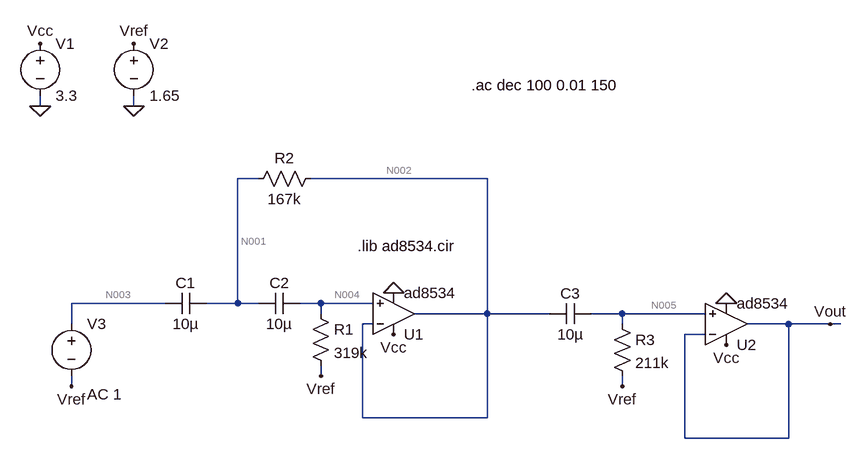
[diagram p0: schematic Draft1.asc]
Draft1.asc, the LTspice schematic file:
Version 4.1
SHEET 1 924 680
WIRE -336 -176 -336 -192
WIRE -192 -176 -192 -192
WIRE 0 -64 -32 -64
WIRE 352 -64 80 -64
WIRE -144 128 -288 128
WIRE -32 128 -32 -64
WIRE -32 128 -80 128
WIRE 0 128 -32 128
WIRE 96 128 64 128
WIRE 176 128 96 128
WIRE 96 144 96 128
WIRE 352 144 352 -64
WIRE 352 144 240 144
WIRE 448 144 352 144
WIRE 560 144 512 144
WIRE 688 144 560 144
WIRE -288 160 -288 128
WIRE 176 160 160 160
WIRE 560 160 560 144
WIRE 816 160 752 160
WIRE 880 160 816 160
WIRE 896 160 880 160
WIRE 688 176 656 176
WIRE 96 240 96 224
WIRE -288 256 -288 240
WIRE 560 256 560 240
WIRE 160 304 160 160
WIRE 352 304 352 144
WIRE 352 304 160 304
WIRE 656 336 656 176
WIRE 816 336 816 160
WIRE 816 336 656 336
FLAG -336 -176 0
FLAG -336 -272 Vcc
FLAG -192 -176 0
FLAG -192 -272 Vref
FLAG 208 176 Vcc
FLAG 208 112 0
FLAG 720 128 0
FLAG 720 192 Vcc
FLAG 880 160 Vout
FLAG -288 256 Vref
FLAG 96 240 Vref
FLAG 560 256 Vref
SYMBOL OpAmps\\opamp2 208 208 M180
SYMATTR InstName U1
SYMATTR Value ad8534
SYMBOL voltage -336 -288 R0
SYMATTR InstName V1
SYMATTR Value 3.3
SYMBOL voltage -192 -288 R0
SYMATTR InstName V2
SYMATTR Value 1.65
SYMBOL voltage -288 144 R0
WINDOW 123 24 124 Left 2
WINDOW 39 0 0 Left 0
SYMATTR InstName V3
SYMATTR Value ""
SYMATTR Value2 AC 1
SYMBOL cap -80 112 R90
WINDOW 0 0 32 VBottom 2
WINDOW 3 32 32 VTop 2
SYMATTR InstName C1
SYMATTR Value 10µ
SYMBOL cap 64 112 R90
WINDOW 0 0 32 VBottom 2
WINDOW 3 32 32 VTop 2
SYMATTR InstName C2
SYMATTR Value 10µ
SYMBOL res 80 128 R0
SYMATTR InstName R1
SYMATTR Value 319k
SYMBOL res 96 -80 R90
WINDOW 0 0 56 VBottom 2
WINDOW 3 32 56 VTop 2
SYMATTR InstName R2
SYMATTR Value 167k
SYMBOL cap 512 128 R90
WINDOW 0 0 32 VBottom 2
WINDOW 3 32 32 VTop 2
SYMATTR InstName C3
SYMATTR Value 10µ
SYMBOL res 544 144 R0
SYMATTR InstName R3
SYMATTR Value 211k
SYMBOL OpAmps\\opamp2 720 224 M180
SYMATTR InstName U2
SYMATTR Value ad8534
TEXT 152 40 Left 2 !.lib ad8534.cir
TEXT 328 -208 Left 2 !.ac dec 100 0.01 150

The netlist it stands for:
* Draft1.asc
X§U1 N004 N002 Vcc 0 N002 ad8534  ; pins In+ In- V+ V- OUT
V1 Vcc 0 3.3
V2 Vref 0 1.65
V3 N003 Vref AC 1
C1 N001 N003 10µ
C2 N004 N001 10µ
R1 N004 Vref 319k
R2 N002 N001 167k
C3 N005 N002 10µ
R3 N005 Vref 211k
X§U2 N005 Vout Vcc 0 Vout ad8534  ; pins In+ In- V+ V- OUT
.lib ad8534.cir
.ac dec 100 0.01 150
.backanno
.end

* Results of the author's LTspice run, read from the files saved beside the schematic
* Operating Point, zero values left out:
*   V(n001) = 1.655 V
*   V(n002) = 1.655 V
*   V(n003) = 1.65 V
*   V(n004) = 1.65 V
*   V(n005) = 1.65 V
*   V(vcc) = 3.3 V
*   V(vout) = 1.655 V
*   V(vref) = 1.65 V
*   I(R1) = -4.5 pA
*   I(R3) = -4.5 pA
*   I(V1) = -1.173 mA
*   I(V2) = -9 pA
*   Ix(u1:1) = 4.5 pA
*   Ix(u1:2) = 5.5 pA
*   Ix(u1:40) = -5.501 pA
*   Ix(u1:50) = -586.6 µA
*   Ix(u1:99) = 586.6 µA
*   Ix(u2:1) = 4.5 pA
*   Ix(u2:2) = 5.5 pA
*   Ix(u2:40) = -5.501 pA
*   Ix(u2:50) = -586.6 µA
*   Ix(u2:99) = 586.6 µA
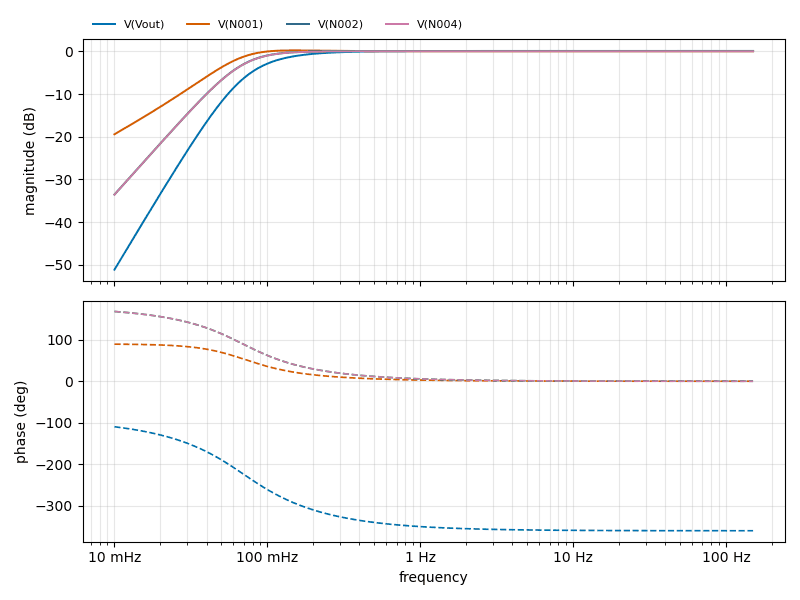
[diagram p1: AC Analysis of Draft1.asc, plotted from the saved traces]
* AC Analysis, 1 run:
*   V(Vout): -51.10 dB at 10 mHz, 0.08 dB at 150 Hz, peak 0.08 dB at 150 Hz, 3 dB below the peak at 99.36 mHz
*   V(N001): -19.42 dB at 10 mHz, -0.00 dB at 150 Hz, peak 0.20 dB at 151.4 mHz, 3 dB below the peak at 55.9 mHz
*   V(N002): -33.51 dB at 10 mHz, 0.04 dB at 150 Hz, peak 0.04 dB at 150 Hz, 3 dB below the peak at 70.29 mHz
*   V(N004): -33.55 dB at 10 mHz, -0.00 dB at 150 Hz, peak -0.00 dB at 150 Hz, 3 dB below the peak at 70.29 mHz